# EAGLE design a_Arduino Shield MAX7219 (EAGLE 7.7.0)
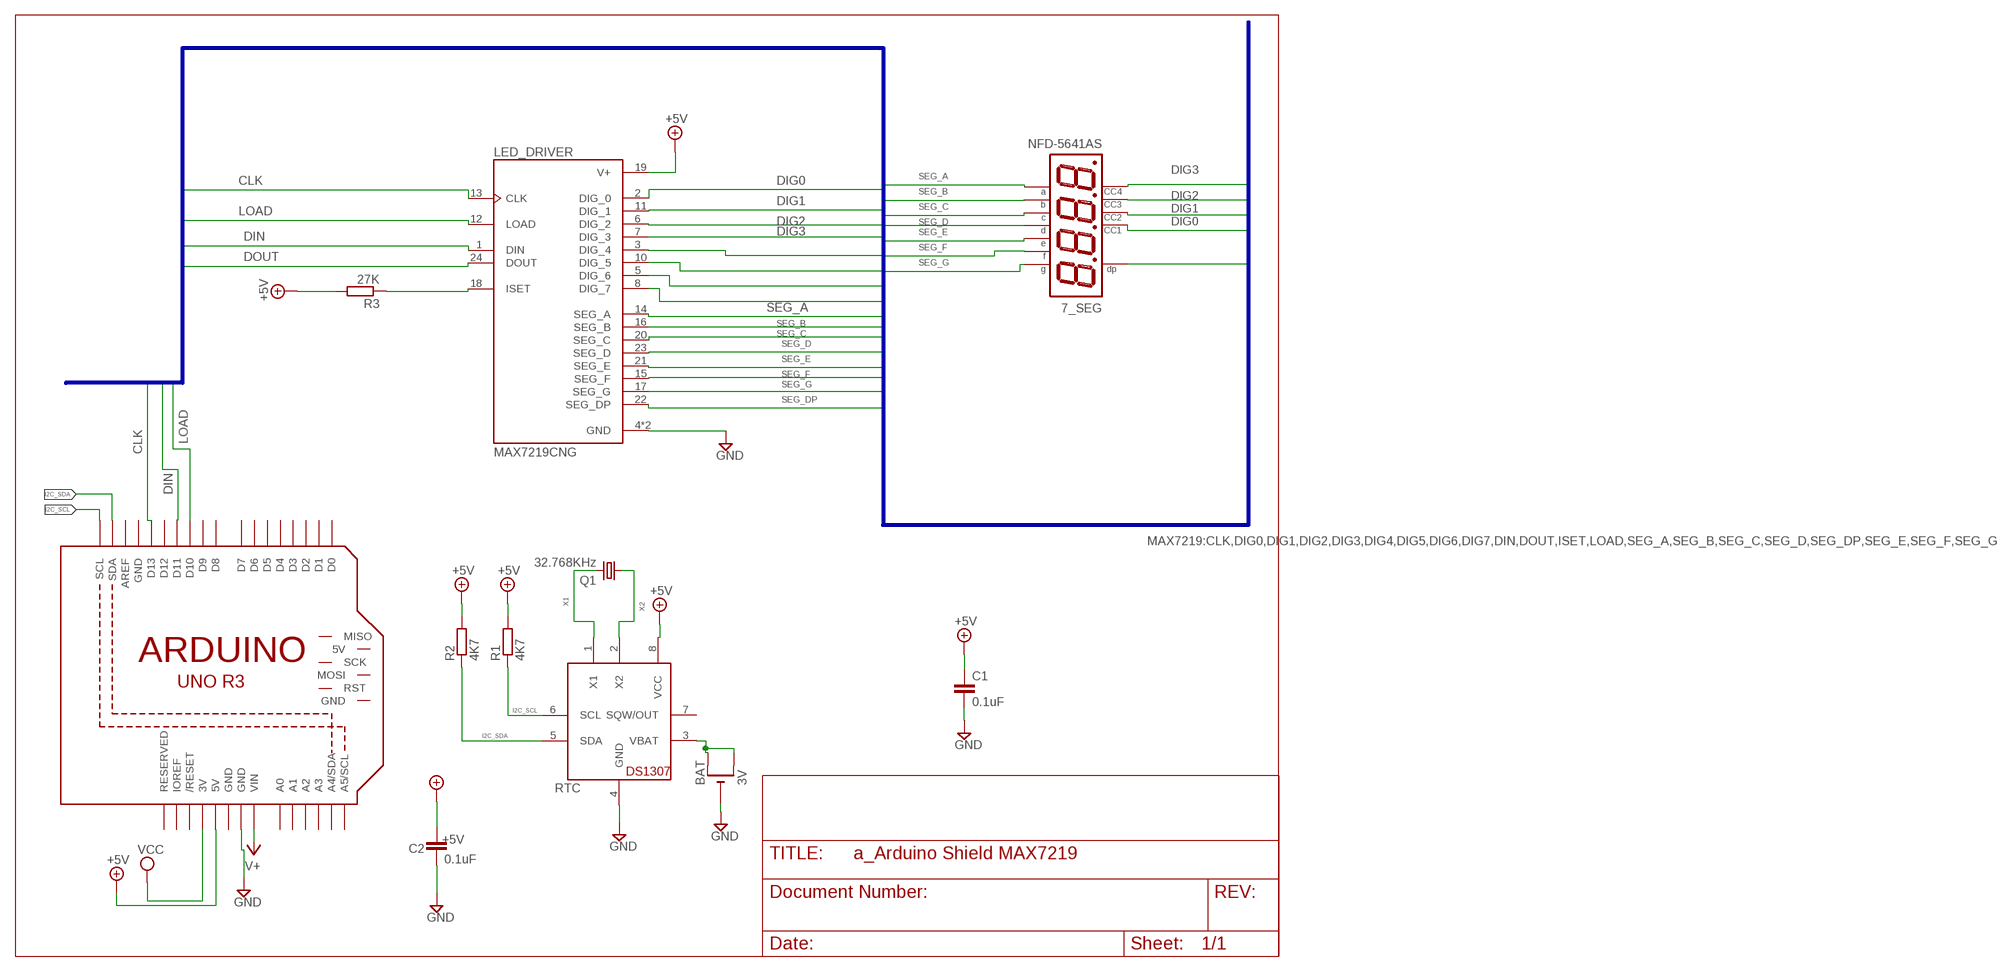
[diagram p0: schematic, sheet 1]

## Parts
7_SEG  NFD-5641AS  [NFD-5641]
BAT  3V  CR1220SMT  [CR1220-SMD]
C1  0.1uF  C-EU050-025X075  [C050-025X075]
C2  0.1uF  C-EU050-025X075  [C050-025X075]
LED_DRIVER  MAX7219CNG  [DIP762W47P254L3054H457Q24B]
M1  ARDUINO_R3_ICSP  [ARDUINOR3_ICSP]
Q1  32.768KHz  CRYSTALTC38H  [TC38H]
R1  4K7  R-EU_M1206  [M1206]
R2  4K7  R-EU_M1206  [M1206]
R3  27K  R-EU_M1206  [M1206]
RTC  DS1307  [DIL08]

## Nets
+5V: C1.1 C2.1 LED_DRIVER.19(V+) M1.5V R1.2 R2.2 R3.2 RTC.8(VCC)
CLK: LED_DRIVER.13(CLK) M1.D13
DIG0: 7_SEG.P$12 LED_DRIVER.2(DIG_0)
DIG1: 7_SEG.P$9 LED_DRIVER.11(DIG_1)
DIG2: 7_SEG.P$8 LED_DRIVER.6(DIG_2)
DIG3: 7_SEG.P$6 LED_DRIVER.7(DIG_3)
DIG4: LED_DRIVER.3(DIG_4)
DIG5: LED_DRIVER.10(DIG_5)
DIG6: LED_DRIVER.5(DIG_6)
DIG7: LED_DRIVER.8(DIG_7)
DIN: LED_DRIVER.1(DIN) M1.D11
DOUT: LED_DRIVER.24(DOUT)
GND: BAT.- C1.2 C2.2 LED_DRIVER.4(GND) LED_DRIVER.9(GND) M1.GND@3(GND) RTC.4(GND)
I2C_SCL: M1.SCL R1.1 RTC.6(SCL)
I2C_SDA: M1.SDA R2.1 RTC.5(SDA)
LOAD: LED_DRIVER.12(LOAD) M1.D10
N$1: LED_DRIVER.18(ISET) R3.1
N$4: BAT.+$1(+) BAT.+$2(+1) RTC.3(VBAT)
SEG_A: 7_SEG.P$11 LED_DRIVER.14(SEG_A)
SEG_B: 7_SEG.P$7 LED_DRIVER.16(SEG_B)
SEG_C: 7_SEG.P$4 LED_DRIVER.20(SEG_C)
SEG_D: 7_SEG.P$2 LED_DRIVER.23(SEG_D)
SEG_DP: 7_SEG.P$3 LED_DRIVER.22(SEG_DP)
SEG_E: 7_SEG.P$1 LED_DRIVER.21(SEG_E)
SEG_F: 7_SEG.P$10 LED_DRIVER.15(SEG_F)
SEG_G: 7_SEG.P$5 LED_DRIVER.17(SEG_G)
V+: M1.VIN
VCC: M1.3V
X1: Q1.2 RTC.1(X1)
X2: Q1.1 RTC.2(X2)
Unconnected: M1.5V_ICSP(5V) M1.A0 M1.A1 M1.A2 M1.A3 M1.A4(A4/SDA) M1.A5(A5/SCL) M1.AREF M1.D0 M1.D1 M1.D2 M1.D3 M1.D4 M1.D5 M1.D6 M1.D7 M1.D8 M1.D9 M1.D12 M1.GND@2(GND) M1.IOREF M1.MISO M1.MOSI M1.RESERVED M1.RESET(/RESET) M1.RESET_ICSP(RST) M1.SCK RTC.7(SQW/OUT)

## Buses
MAX7219:CLK,DIG0,DIG1,DIG2,DIG3,DIG4,DIG5,DIG6,DIG7,DIN,DOUT,ISET,LOAD,SEG_A,SEG_B,SEG_C,SEG_D,SEG_DP,SEG_E,SEG_F,SEG_G

## Power pins joined to a net without a drawn wire
GND: M1.GND M1.GND@1(GND)

## Library data of the parts
7_SEG = display-nfd:NFD-5641AS: Four Digit 0.56" CC Seven-Segment LED Display Futurlec part number: 7FR5641AS Created by RobG
BAT = CR1220:CR1220: Check availability <https://pricing.snapeda.com/parts/CR1220/FDK%20America/view-part?ref=eda>; AVAILABILITY: In Stock; CHECK_PRICES: https://www.snapeda.com/parts/CR1220/FDK/view-part/?ref=eda; DESCRIPTION: Button cell battery, Lithium, 3 V, 40 mAh | Energizer CR1220 @ Button cell battery (Button cell battery, Lithium, 3 V, 40 mAh Standard Batteries).; MF: FDK America; MP: CR1220; PACKAGE: FDK America, Inc., a member of Fujitsu Group; PRICE: None; SNAPEDA_LINK: https://www.snapeda.com/parts/CR1220/FDK/view-part/?ref=snap
C1 C2 = rcl:C-EU: CAPACITOR, European symbol; SPICEPREFIX: C
LED_DRIVER = MAX7219CNG:MAX7219CNG: Check availability <https://pricing.snapeda.com/parts/MAX7219CNG/Analog%20Devices/view-part?ref=eda>; AVAILABILITY: In Stock; CHECK_PRICES: https://www.snapeda.com/parts/MAX7219CNG/Analog+Devices/view-part/?ref=eda; DESCRIPTION: IC DRVR 7 SEGMENT 8 DIGIT 24DIP; MF: Analog Devices; MP: MAX7219CNG; PACKAGE: DIP-24 Maxim Integrated; PRICE: None; SNAPEDA_LINK: https://www.snapeda.com/parts/MAX7219CNG/Analog+Devices/view-part/?ref=snap
M1 = adafruit:ARDUINO_R3_ICSP
Q1 = crystal:CRYSTAL: CRYSTAL; OC_FARNELL: unknown; OC_NEWARK: unknown
R1-R3 = rcl:R-EU_: RESISTOR, European symbol; SPICEPREFIX: R
RTC = adafruit:DS1307: DS1307 Real time clock (RTC) with battery backup ability. Talk to it via i2c

## Board
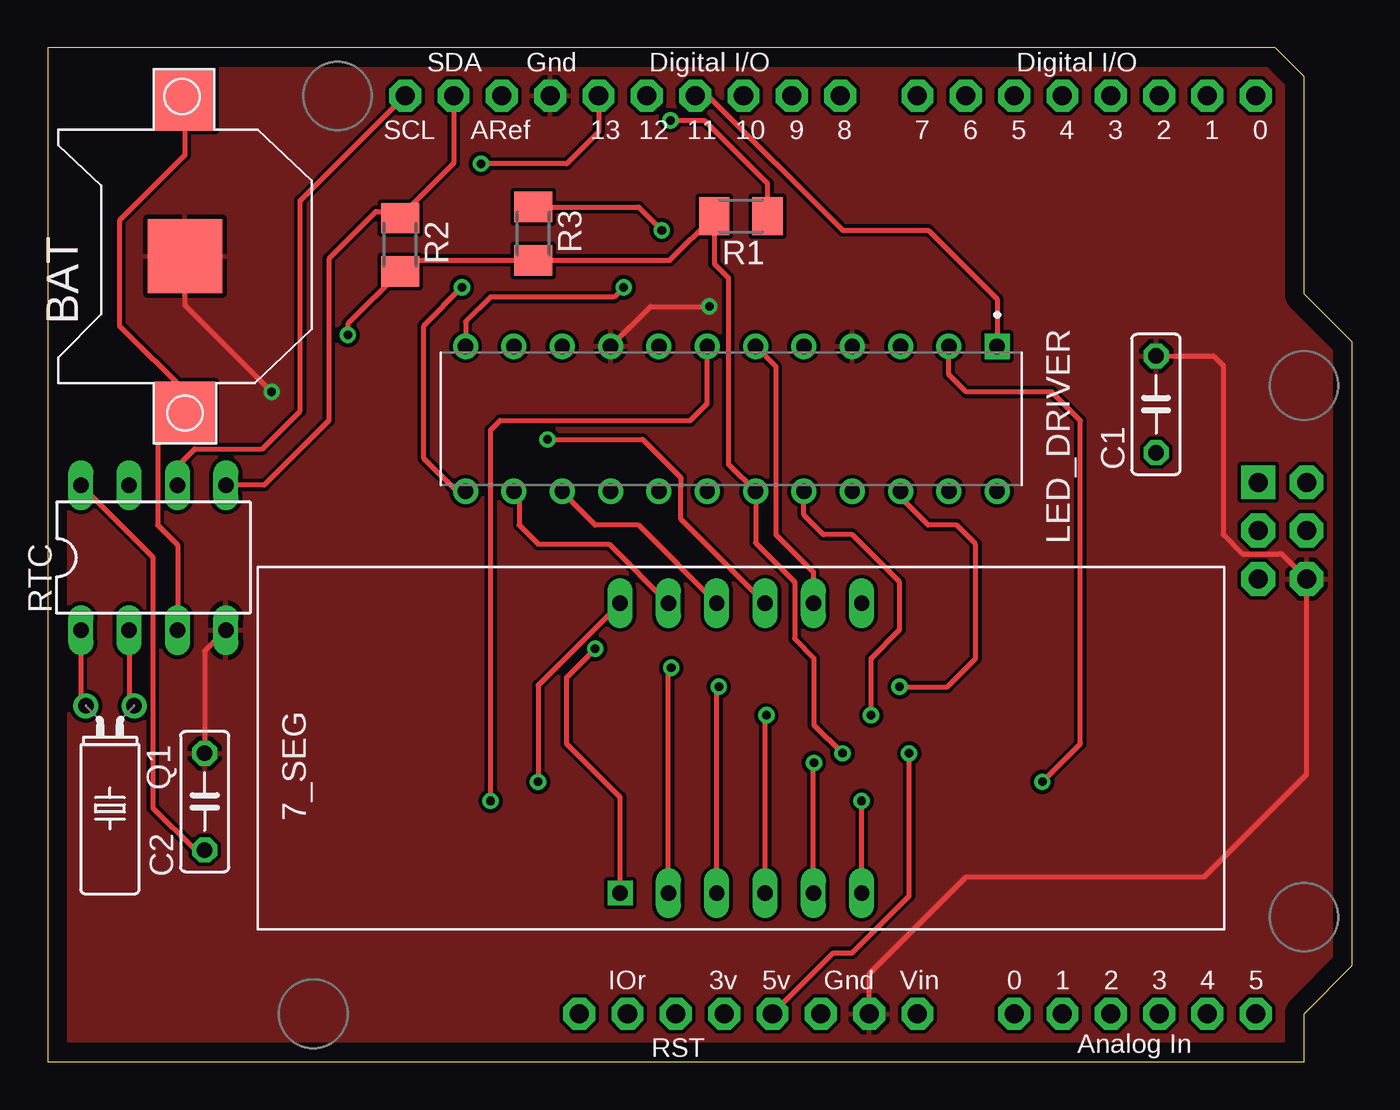
[diagram p1: board, top side]
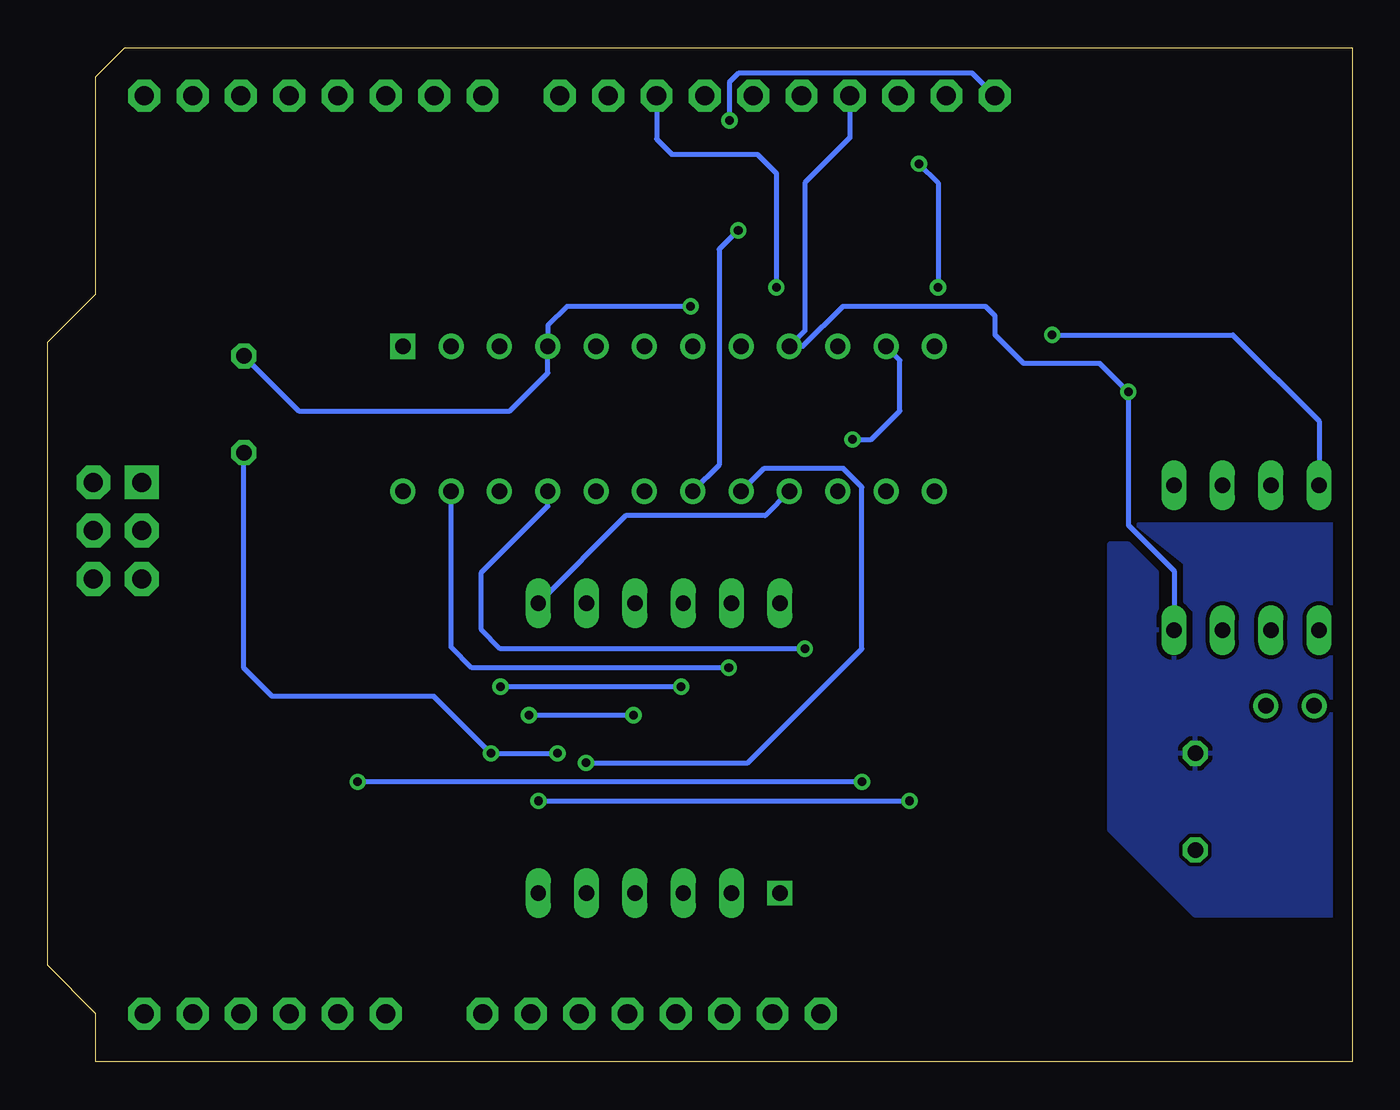
[diagram p2: board, bottom side, seen from below]

Size 68.58 x 53.34 mm. Coordinates in mm from the lower left corner, seen from the top.
Copper layers (1*16): Top 0.035mm / dielectric 1.5mm / Bottom 0.035mm
Design rules "default *": minimum track width 10mil, minimum drill 0.45mm, track to track 8mil, track to pad 8mil, pad to pad 8mil, via to via 8mil, smd to smd 8mil, copper to edge 40mil, drill to drill 6mil, minimum pad ring 10mil, minimum via ring 8mil, stop-mask expansion 4mil, vias tented up to drill 0mil, thermal gap 10mil

### Footprints (pad centres in the part's own frame; a part is rotated, then mirrored left to right if it is on the bottom)
NFD-5641 = drill 0.8 square: P$1 -6.35,-7.62 | drill 0.8 long: P$2 -3.81,-7.62; P$3 -1.27,-7.62; P$4 1.27,-7.62; P$5 3.81,-7.62; P$6 6.35,-7.62; P$7 6.35,7.62; P$8 3.81,7.62; P$9 1.27,7.62; P$10 -1.27,7.62; P$11 -3.81,7.62; P$12 -6.35,7.62
CR1220-SMD = smd 3.2 x 3.2: +$1 -8.2,0; +$2 8.2,0 | smd 3.9 x 3.9: - 0,0
C050-025X075 = drill 0.813 octagon: 1 -2.54,0; 2 2.54,0
DIP762W47P254L3054H457Q24B = drill 0.81 square: 1 -3.81,13.97 | drill 0.81: 2 -3.81,11.43; 3 -3.81,8.89; 4 -3.81,6.35; 5 -3.81,3.81; 6 -3.81,1.27; 7 -3.81,-1.27; 8 -3.81,-3.81; 9 -3.81,-6.35; 10 -3.81,-8.89; 11 -3.81,-11.43; 12 -3.81,-13.97; 13 3.81,-13.97; 14 3.81,-11.43; 15 3.81,-8.89; 16 3.81,-6.35; 17 3.81,-3.81; 18 3.81,-1.27; 19 3.81,1.27; 20 3.81,3.81; 21 3.81,6.35; 22 3.81,8.89; 23 3.81,11.43; 24 3.81,13.97
ARDUINOR3_ICSP = drill 1 pad 1.676 octagon: 3V 35.56,2.54; 5V 38.1,2.54; A0 50.8,2.54; A1 53.34,2.54; A2 55.88,2.54; A3 58.42,2.54; A4 60.96,2.54; A5 63.5,2.54; AREF 23.876,50.8; D0 63.5,50.8; D1 60.96,50.8; D2 58.42,50.8; D3 55.88,50.8; D4 53.34,50.8; D5 50.8,50.8; D6 48.26,50.8; D7 45.72,50.8; D8 41.656,50.8; D9 39.116,50.8; D10 36.576,50.8; D11 34.036,50.8; D12 31.496,50.8; D13 28.956,50.8; GND 26.416,50.8; GND@1 43.18,2.54; GND@2 40.64,2.54; IOREF 30.48,2.54; RESERVED 27.94,2.54; RESET 33.02,2.54; SCL 18.796,50.8; SDA 21.336,50.8; VIN 45.72,2.54 | drill 1 pad 1.778 octagon: 5V_ICSP 66.167,30.48; GND@3 66.167,25.4; MOSI 66.167,27.94; RESET_ICSP 63.627,25.4; SCK 63.627,27.94 | drill 1 pad 1.778 square: MISO 63.627,30.48
TC38H = drill 0.813: 1 -1.27,0; 2 1.27,0
M1206 = smd 1.6 x 2: 1 -1.4,0; 2 1.4,0
DIL08 = drill 0.813 long: 1 -3.81,-3.81; 2 -1.27,-3.81; 3 1.27,-3.81; 4 3.81,-3.81; 5 3.81,3.81; 6 1.27,3.81; 7 -1.27,3.81; 8 -3.81,3.81

### Placement (x,y rotation side)
7_SEG  36.44,16.5 0 top
BAT  7.22,42.37 90 top
C1  58.26,34.58 90 top
C2  8.26,13.69 90 top
LED_DRIVER  35.94,33.82 270 top
M1  0,0 0 top
Q1  3.28,18.73 180 top
R1  36.44,44.48 180 top
R2  18.53,42.97 270 top
R3  25.53,43.55 270 top
RTC  5.56,26.52 0 top

### Tracks (layer width: path | path; a pad name or v marks a point on that pad's centre or on a via)
+5V  (via drill 0.45)
  Top 0.254: RTC.8 5.54,26.54 5.54,13.37 7.76,11.15 C2.1 | v15.78,38.23 15.78,38.82 R2.2 18.57,41.74 18.98,42.15 R3.2 32.71,42.15 R1.2 35.04,41.97 35.78,41.23 35.78,31.44 LED_DRIVER.19 37.21,27.3 39.27,25.24 39.27,22.24 40.28,21.23 40.28,17.73 v41.78,16.23 | M1.5V 41.29,5.73 42.28,5.73 45.28,8.73 v45.28,16.23
  Bottom 0.254: v15.78,38.23 6.28,38.23 1.75,33.7 RTC.8 | v41.78,16.23 v45.28,16.23 48.28,19.23 56.78,19.23 58.26,20.71 C1.1
CLK  (via drill 0.45)
  Top 0.254: M1.D13 28.96,48.91 27.28,47.23 v22.78,47.23 | v21.78,40.73 19.78,38.73 19.78,31.73 21.5,30.01 LED_DRIVER.13
  Bottom 0.254: v22.78,47.23 21.78,46.23 v21.78,40.73
DIG0  (via drill 0.45)
  Top 0.254: 7_SEG.P$12 25.78,19.81 v25.78,14.73 | v52.28,14.73 54.28,16.73 54.28,33.73 52.78,35.23 48.28,35.23 47.37,36.14 LED_DRIVER.2
  Bottom 0.254: v25.78,14.73 v52.28,14.73
DIG1  (via drill 0.45)
  Top 0.254: 7_SEG.P$9 33.28,28.55 33.28,30.23 33.28,30.26 33.28,30.73 31.28,32.73 v26.28,32.73
  Bottom 0.254: v26.28,32.73 25.28,32.73 23.78,34.23 23.78,36.9 LED_DRIVER.11
DIG2
  Top 0.254: LED_DRIVER.6 38.28,36.56 38.28,27.73 40.25,25.76 7_SEG.P$8
DIG3  (via drill 0.45)
  Top 0.254: 7_SEG.P$6 v42.79,13.72 v42.78,13.73 | v23.28,13.73 23.28,33.23 23.78,33.73 33.78,33.73 34.67,34.62 LED_DRIVER.7
  Bottom 0.254: v42.78,13.73 v23.28,13.73
DIN
  Top 0.254: M1.D11 34.71,50.8 41.78,43.73 46.28,43.73 49.91,40.1 LED_DRIVER.1
GND  (via drill 0.45)
  Top 0.254: M1.GND@1 43.18,4.63 48.28,9.73 60.78,9.73 66.17,15.12 M1.GND@3 64.84,26.73 64.78,26.73 64.77,26.72 62.79,26.72 61.78,27.73 61.78,36.62 61.28,37.12 C1.2 | RTC.4 8.26,21.6 C2.2 | BAT.- 7.22,39.79 v11.78,35.23 | LED_DRIVER.9 31.69,39.73 v34.78,39.73
  Bottom 0.254: RTC.4 9.37,25.82 11.78,28.23 v11.78,35.23 13.28,36.73 17.28,36.73 18.78,38.23 18.78,39.23 19.28,39.73 26.78,39.73 28.88,37.63 LED_DRIVER.9 28.78,38.44 28.78,46.23 26.42,48.59 M1.GND | C1.2 55.37,34.23 44.28,34.23 42.28,36.23 LED_DRIVER.4 42.29,38.72 41.28,39.73 v34.78,39.73
  pour Bottom: -0.22,28.23 11.28,28.23 8.78,26.23 8.78,24.23 8.28,23.73 8.28,21.73 8.78,21.23 9.78,21.23 10.28,21.73 10.28,25.73 11.78,27.23 12.78,27.23 12.78,12.23 9.78,9.23 8.28,7.73 -0.22,7.73
  pour Top: -0.22,53.23 64.78,53.23 66.28,51.73 66.28,40.23 68.78,37.73 68.78,5.23 66.28,2.73 66.28,-0.27 -0.22,-0.27
I2C_SCL  (via drill 0.45)
  Top 0.254: RTC.6 6.83,31.33 7.73,32.23 11.28,32.23 13.28,34.23 13.28,45.28 M1.SCL | v32.74,49.51 34.5,49.51 37.84,46.17 37.84,44.73 37.77,44.66 37.77,44.48 R1.1
  Bottom 0.254: M1.SCL 20,52.01 32.24,52.01 32.74,51.51 v32.74,49.51
I2C_SDA
  Top 0.254: R2.1 18.34,44.25 18.8,44.71 | M1.SDA 21.34,47.25 18.8,44.71 | 18.8,44.71 17.26,44.71 14.78,42.23 14.78,33.73 11.38,30.33 RTC.5
LOAD  (via drill 0.45)
  Top 0.254: v30.28,40.73 29.78,40.23 23.28,40.23 21.97,38.92 LED_DRIVER.12
  Bottom 0.254: M1.D10 36.58,48.53 35.78,47.73 31.28,47.73 30.28,46.73 v30.28,40.73
N$1  (via drill 0.45)
  Top 0.254: R3.1 31.06,44.95 v32.28,43.73
  Bottom 0.254: v32.28,43.73 33.28,42.73 33.28,31.4 LED_DRIVER.18
N$4
  Top 0.254: BAT.+$2 7.22,47.67 3.78,44.23 3.78,38.73 7.44,35.07 7.22,34.85 BAT.+$1 5.78,32.73 5.78,28.23 6.83,27.18 RTC.3
SEG_A
  Top 0.254: LED_DRIVER.14 24.78,29.74 24.78,28.23 25.78,27.23 29.52,27.23 7_SEG.P$11
SEG_B
  Bottom 0.254: LED_DRIVER.16 30.87,28.73 38.18,28.73 7_SEG.P$7
SEG_C  (via drill 0.45)
  Top 0.254: 7_SEG.P$4 37.71,18.16 v37.78,18.23 | v43.28,18.23 43.28,21.23 44.78,22.73 44.78,25.23 42.28,27.73 40.78,27.73 39.75,28.76 LED_DRIVER.20
  Bottom 0.254: v37.78,18.23 v43.28,18.23
SEG_D  (via drill 0.45)
  Top 0.254: 7_SEG.P$2 32.63,20.58 v32.78,20.73
  Bottom 0.254: v32.78,20.73 46.28,20.73 47.37,21.82 LED_DRIVER.23
SEG_DP  (via drill 0.45)
  Top 0.254: 7_SEG.P$3 35.17,19.62 v35.28,19.73 | v44.78,19.73 47.28,19.73 48.78,21.23 48.78,27.23 47.78,28.23 46.28,28.23 44.83,29.68 LED_DRIVER.22
  Bottom 0.254: v35.28,19.73 v44.78,19.73
SEG_E  (via drill 0.45)
  Top 0.254: 7_SEG.P$1 30.09,13.92 27.28,16.73 27.28,20.23 v28.78,21.73
  Bottom 0.254: LED_DRIVER.21 42.29,29.22 45.78,25.73 45.78,22.73 44.78,21.73 v28.78,21.73
SEG_F
  Top 0.254: 7_SEG.P$10 31.06,28.23 28.78,28.23 27.05,29.96 LED_DRIVER.15
SEG_G  (via drill 0.45)
  Top 0.254: 7_SEG.P$5 40.25,15.7 v40.28,15.73
  Bottom 0.254: v40.28,15.73 31.78,15.73 25.78,21.73 25.78,30.23 26.78,31.23 30.91,31.23 LED_DRIVER.17
X1
  Top 0.254: RTC.1 1.75,18.99 Q1.2
X2
  Top 0.254: RTC.2 4.29,18.99 Q1.1